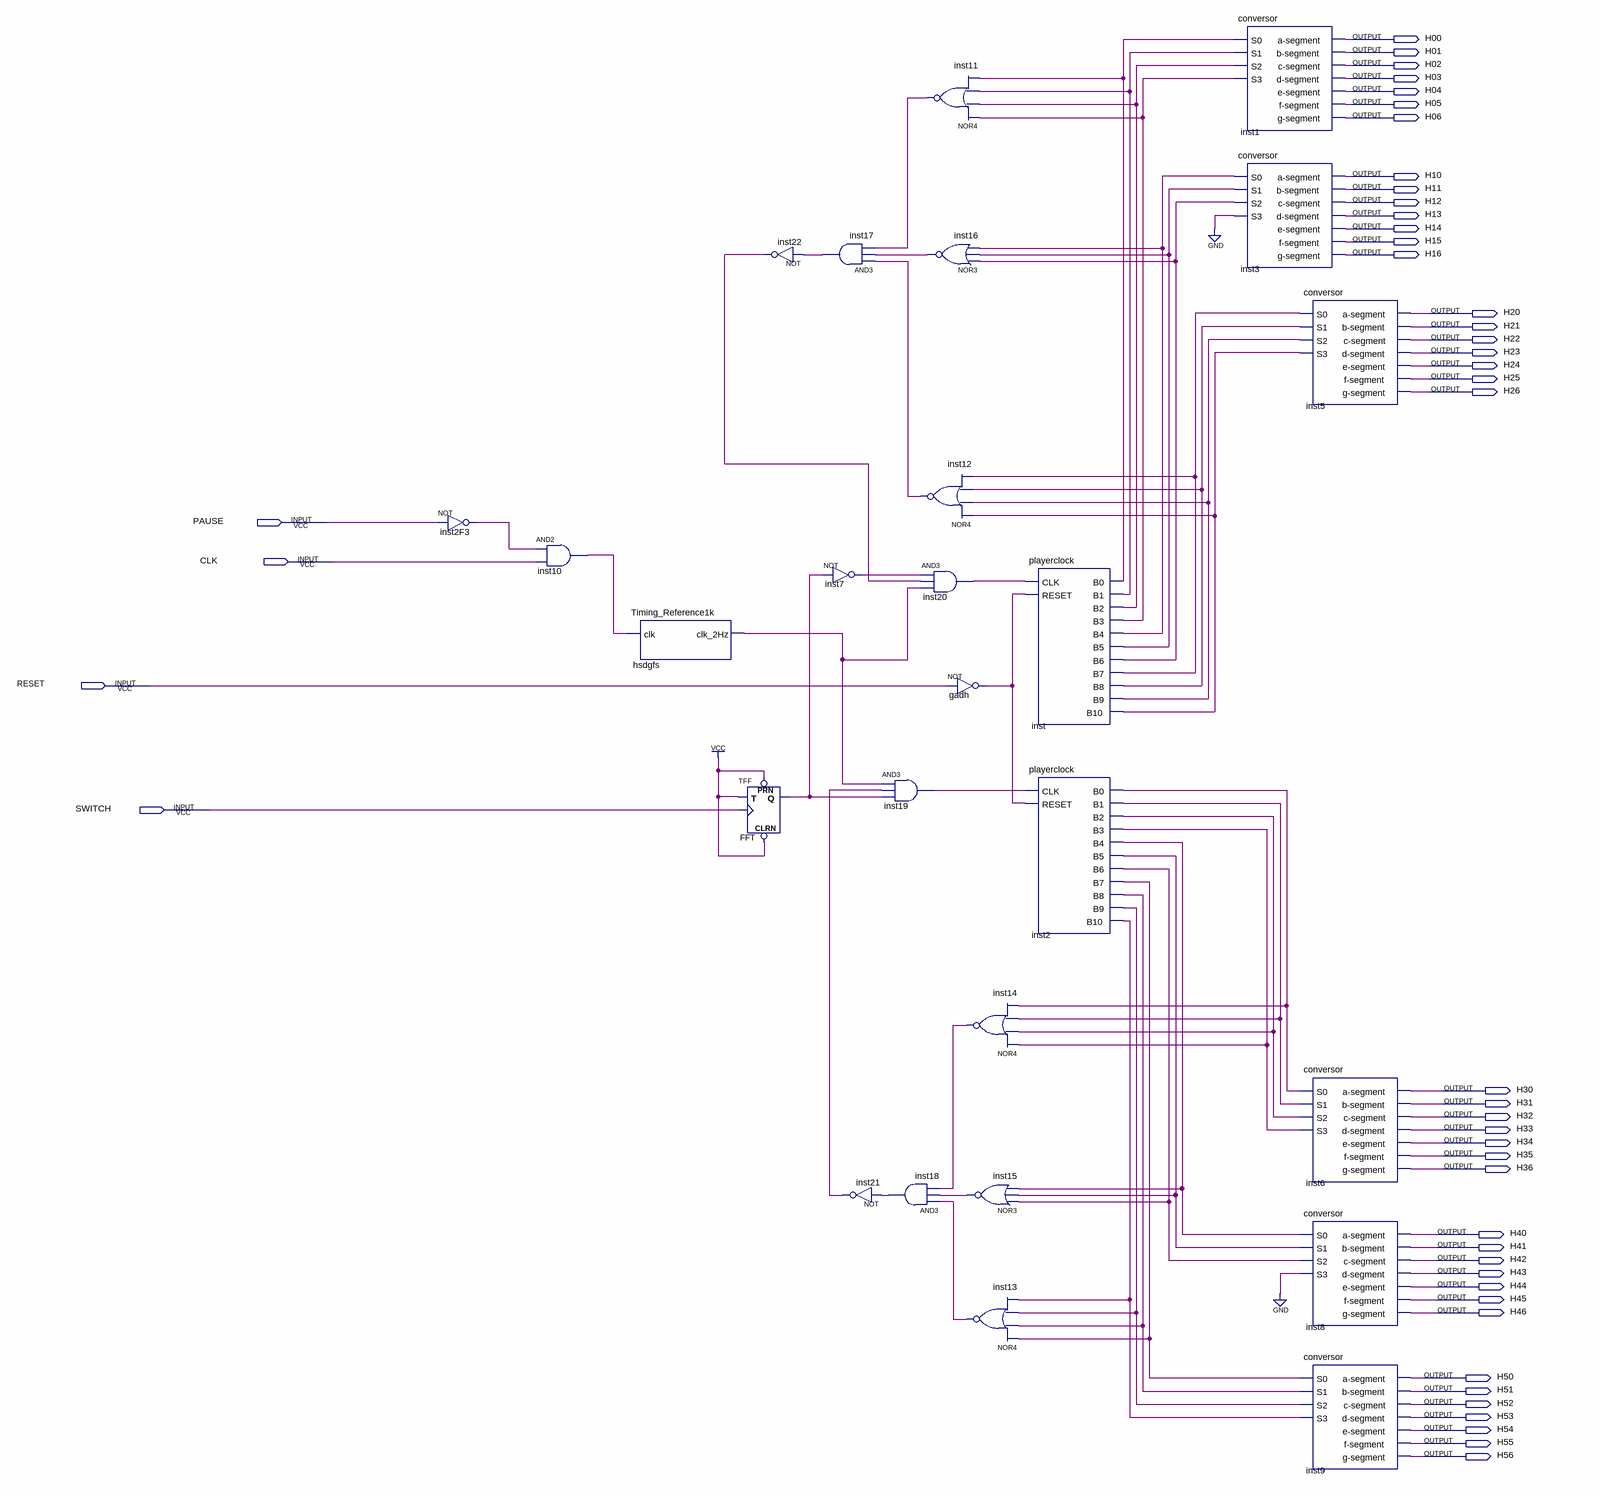
[diagram p0: schematic sheet]
// Quartus schematic project.bdf as structural Verilog: 26 symbols, 46 pins
module project (
  input  PAUSE,
  input  CLK,
  input  RESET,
  input  SWITCH,
  output H00,
  output H01,
  output H02,
  output H03,
  output H04,
  output H05,
  output H06,
  output H10,
  output H11,
  output H12,
  output H13,
  output H14,
  output H15,
  output H16,
  output H20,
  output H21,
  output H22,
  output H23,
  output H24,
  output H25,
  output H26,
  output H30,
  output H31,
  output H32,
  output H33,
  output H34,
  output H35,
  output H36,
  output H40,
  output H41,
  output H42,
  output H43,
  output H44,
  output H45,
  output H46,
  output H50,
  output H51,
  output H52,
  output H53,
  output H54,
  output H55,
  output H56
);

  wire FFT_q, gadh_out, hsdgfs_clk_2hz, inst2_b0, inst2_b1, inst2_b2, inst2_b3, inst2_b4, inst2_b5, inst2_b6,
       inst2_b7, inst2_b8, inst2_b9, inst2_b10, inst2F3_out, inst7_out, inst10_out, inst11_out, inst12_out,
       inst13_out, inst14_out, inst15_out, inst16_out, inst17_out, inst18_out, inst19_out, inst20_out,
       inst21_out, inst22_out, inst_b0, inst_b1, inst_b2, inst_b3, inst_b4, inst_b5, inst_b6, inst_b7,
       inst_b8, inst_b9, inst_b10;

  not inst2F3 (inst2F3_out, PAUSE);
  and inst10 (inst10_out, inst2F3_out, CLK);
  Timing_Reference1k hsdgfs (.clk(inst10_out), .clk_2Hz(hsdgfs_clk_2hz));
  not inst22 (inst22_out, inst17_out);
  TFF FFT (.PRN(1'b1), .CLRN(1'b1), .T(1'b1), .CLK(SWITCH), .Q(FFT_q));
  and inst17 (inst17_out, inst12_out, inst16_out, inst11_out);
  not inst7 (inst7_out, FFT_q);
  not inst21 (inst21_out, inst18_out);
  nor inst12 (inst12_out, inst_b10, inst_b9, inst_b8, inst_b7);
  and inst20 (inst20_out, inst7_out, inst22_out, hsdgfs_clk_2hz);
  and inst19 (inst19_out, hsdgfs_clk_2hz, inst21_out, FFT_q);
  and inst18 (inst18_out, inst13_out, inst15_out, inst14_out);
  nor inst11 (inst11_out, inst_b3, inst_b2, inst_b1, inst_b0);
  nor inst16 (inst16_out, inst_b6, inst_b5, inst_b4);
  not gadh (gadh_out, RESET);
  nor inst14 (inst14_out, inst2_b3, inst2_b2, inst2_b1, inst2_b0);
  nor inst15 (inst15_out, inst2_b6, inst2_b5, inst2_b4);
  nor inst13 (inst13_out, inst2_b7, inst2_b8, inst2_b9, inst2_b10);
  playerclock inst (
    .CLK(inst20_out), .RESET(gadh_out), .B0(inst_b0), .B1(inst_b1), .B2(inst_b2), .B3(inst_b3), .B4(inst_b4),
    .B5(inst_b5), .B6(inst_b6), .B7(inst_b7), .B8(inst_b8), .B9(inst_b9), .B10(inst_b10));
  playerclock inst2 (
    .CLK(inst19_out), .RESET(gadh_out), .B0(inst2_b0), .B1(inst2_b1), .B2(inst2_b2), .B3(inst2_b3),
    .B4(inst2_b4), .B5(inst2_b5), .B6(inst2_b6), .B7(inst2_b7), .B8(inst2_b8), .B9(inst2_b9), .B10(inst2_b10));
  conversor inst1 (
    .S0(inst_b0), .S1(inst_b1), .S2(inst_b2), .S3(inst_b3), .\a-segment (H00), .\b-segment (H01),
    .\c-segment (H02), .\d-segment (H03), .\e-segment (H04), .\f-segment (H05), .\g-segment (H06));
  conversor inst3 (
    .S0(inst_b4), .S1(inst_b5), .S2(inst_b6), .S3(1'b0), .\a-segment (H10), .\b-segment (H11),
    .\c-segment (H12), .\d-segment (H13), .\e-segment (H14), .\f-segment (H15), .\g-segment (H16));
  conversor inst5 (
    .S0(inst_b7), .S1(inst_b8), .S2(inst_b9), .S3(inst_b10), .\a-segment (H20), .\b-segment (H21),
    .\c-segment (H22), .\d-segment (H23), .\e-segment (H24), .\f-segment (H25), .\g-segment (H26));
  conversor inst6 (
    .S0(inst2_b0), .S1(inst2_b1), .S2(inst2_b2), .S3(inst2_b3), .\a-segment (H30), .\b-segment (H31),
    .\c-segment (H32), .\d-segment (H33), .\e-segment (H34), .\f-segment (H35), .\g-segment (H36));
  conversor inst8 (
    .S0(inst2_b4), .S1(inst2_b5), .S2(inst2_b6), .S3(1'b0), .\a-segment (H40), .\b-segment (H41),
    .\c-segment (H42), .\d-segment (H43), .\e-segment (H44), .\f-segment (H45), .\g-segment (H46));
  conversor inst9 (
    .S0(inst2_b7), .S1(inst2_b8), .S2(inst2_b9), .S3(inst2_b10), .\a-segment (H50), .\b-segment (H51),
    .\c-segment (H52), .\d-segment (H53), .\e-segment (H54), .\f-segment (H55), .\g-segment (H56));
endmodule
